# Altium project UZ_A_Template.PrjPCB
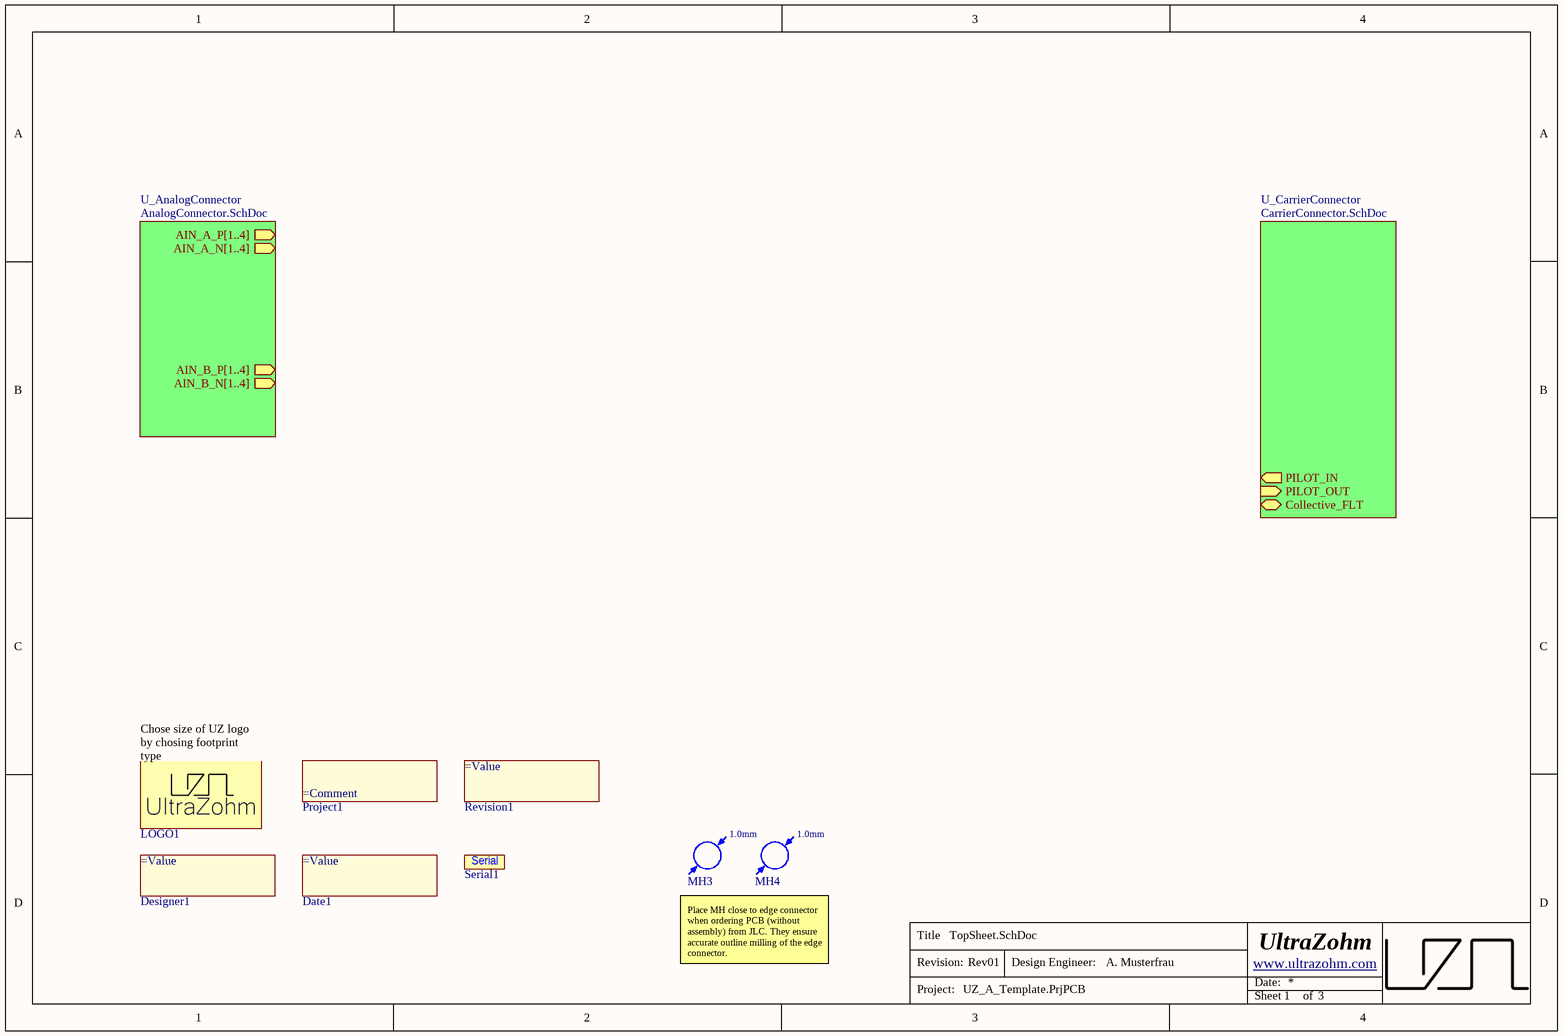
[diagram p0: TopSheet.SchDoc]
Author: A. Musterfrau; AuthorParam: A. Musterfrau; FinDate: 01/2023; ProjectNameCustom: UZ_A_Template; ProjectRevision: Rev01
3 sheets, 49 parts. Net scope: hierarchical (ports join the sheet entries above them; power ports are global).
Board file: UZ_A_Template.PcbDoc
Sheets:
  TopSheet.SchDoc
    U_CarrierConnector = CarrierConnector.SchDoc
    U_AnalogConnector = AnalogConnector.SchDoc

## Sheet TopSheet.SchDoc
size A4; Author: A. Musterfrau; CompanyName: Technische Hochschule Nürnberg Georg Simon Ohm; Organization: UltraZohm; Address1: Kesslerplatz 12; Address2: 90489 Nürnberg; Address3: GERMANY; DocumentNumber: 1; SheetNumber: 1; SheetTotal: 3; Website: www.ultrazohm.com

### Parts
Date1  (no value)  [COMMENT]  (no BOM)
Designer1  (no value)  [Designator:comment]  (no BOM)
LOGO1  UZ Logo  [UZ_Logo_small]  (value not drawn)  (no BOM)
MH3  alignment hole 1mm  [MH_1]  (value not drawn)
MH4  alignment hole 1mm  [MH_1]  (value not drawn)
Project1  (no value)  [COMMENT]  (no BOM)
Revision1  (no value)  [Designator:comment]  (no BOM)
Serial1  Serial #  [SERIAL]  (value not drawn)

### Sub-sheets
U_AnalogConnector = AnalogConnector.SchDoc: AIN_B_P[1..4] (out), AIN_B_N[1..4] (out), AIN_A_N[1..4] (out), AIN_A_P[1..4] (out)
U_CarrierConnector = CarrierConnector.SchDoc: PILOT_OUT (in), PILOT_IN (out), Collective_FLT (bidir)

### Notes on the sheet
- (near LOGO1) Chose size of UZ logo by chosing footprint type
- Place MH close to edge connector when ordering PCB (without assembly) from JLC. They ensure accurate outline milling of the edge connector.
- Title
- Revision:
- Design Engineer:
- Date:
- Project:
- Sheet
- of
- (in symbol 6) Serial
- (in symbol Mounting Hole - 1mm) 1.0mm

### Library data of the parts
Date1 = 5: Create a project parameter named "FinDate" this is the value of this component. It is printed on the PCB. Once the parameter is updated (e.g. new revision) it gets updated on the PCB as well; Manufacturer: PCB Manufacturer; Manufacturer Part Number: Project End Date; Value: 01/2023; Created from: T. Wendt; PartID: 5; Created On: 01.03.2021 09:01:41; Component Type: Date of Project Finalization; Last Updated: 01.03.2021 09:01:41; Type: Standard (No BOM); Live Cycle Status: 1
Designer1 = 4: Create a project parameter named "Author" this is the value of this component. It is printed on the PCB. Once the parameter is updated (e.g. new revision) it gets updated on the PCB as well; Manufacturer: PCB Manufacturer; Manufacturer Part Number: Project Author; Value: A. Musterfrau; Created from: T. Wendt; PartID: 4; Created On: 01.03.2021 08:53:41; Component Type: Project Author; Last Updated: 01.03.2021 09:20:27; Type: Standard (No BOM); Live Cycle Status: 1
LOGO1 = 1: Official Project Logo of the UltraZohm; Manufacturer: PCB Manufacturer; Manufacturer Part Number: UltraZohm Logo; Created from: T. Wendt; PartID: 1; Created On: 19.02.2021 16:55:56; ComponentLink1Description: Homepage; ComponentLink1URL: https://ultrazohm.com; Component Type: Logo; Last Updated: 02.03.2021 14:31:24; Type: Standard (No BOM); Live Cycle Status: 1
MH3 MH4 = Mounting Hole - 1mm: Non plated through hole, 1mm
Project1 = 2: Create a project parameter named "ProjectNameCustom" this is the value of this component and it is printed on the PCB.; Manufacturer: PCB Manufacturer; Value: UZ_A_Template; Created from: T. Wendt; PartID: 2; Created On: 01.03.2021 08:43:57; Component Type: Project Name; Last Updated: 01.03.2021 09:07:27; Manufacturer Part Number: Project Name; Type: Standard (No BOM); Live Cycle Status: 1
Revision1 = 3: Create a project parameter named "ProjectRevision" this is the value of this component. It is printed on the PCB. Once the parameter is updated (e.g. new revision) it gets updated on the PCB as well; Manufacturer: PCB Manufacturer; Value: Rev01; Created from: T. Wendt; PartID: 3; Created On: 01.03.2021 08:50:34; Component Type: Project Revision; Last Updated: 01.03.2021 09:28:36; Manufacturer Part Number: Project Revision; Type: Standard (No BOM); Live Cycle Status: 1
Serial1 = 6: Field to put in a serial number; Manufacturer: PCB Manufacturer; Created from: T. Wendt; PartID: 6; Created On: 02.03.2021 14:31:24; Component Type: Serial Number; Last Updated: 02.03.2021 14:31:24; Manufacturer Part Number: Serial Number; Type: Standard (No BOM); Live Cycle Status: 1

## Sheet CarrierConnector.SchDoc
size A4; Author: A. Musterfrau; CompanyName: Technische Hochschule Nürnberg Georg Simon Ohm; Organization: UltraZohm; Address1: Kesslerplatz 12; Address2: 90489 Nürnberg; Address3: GERMANY; DocumentNumber: 2; SheetNumber: 2; SheetTotal: 3; Website: www.ultrazohm.com
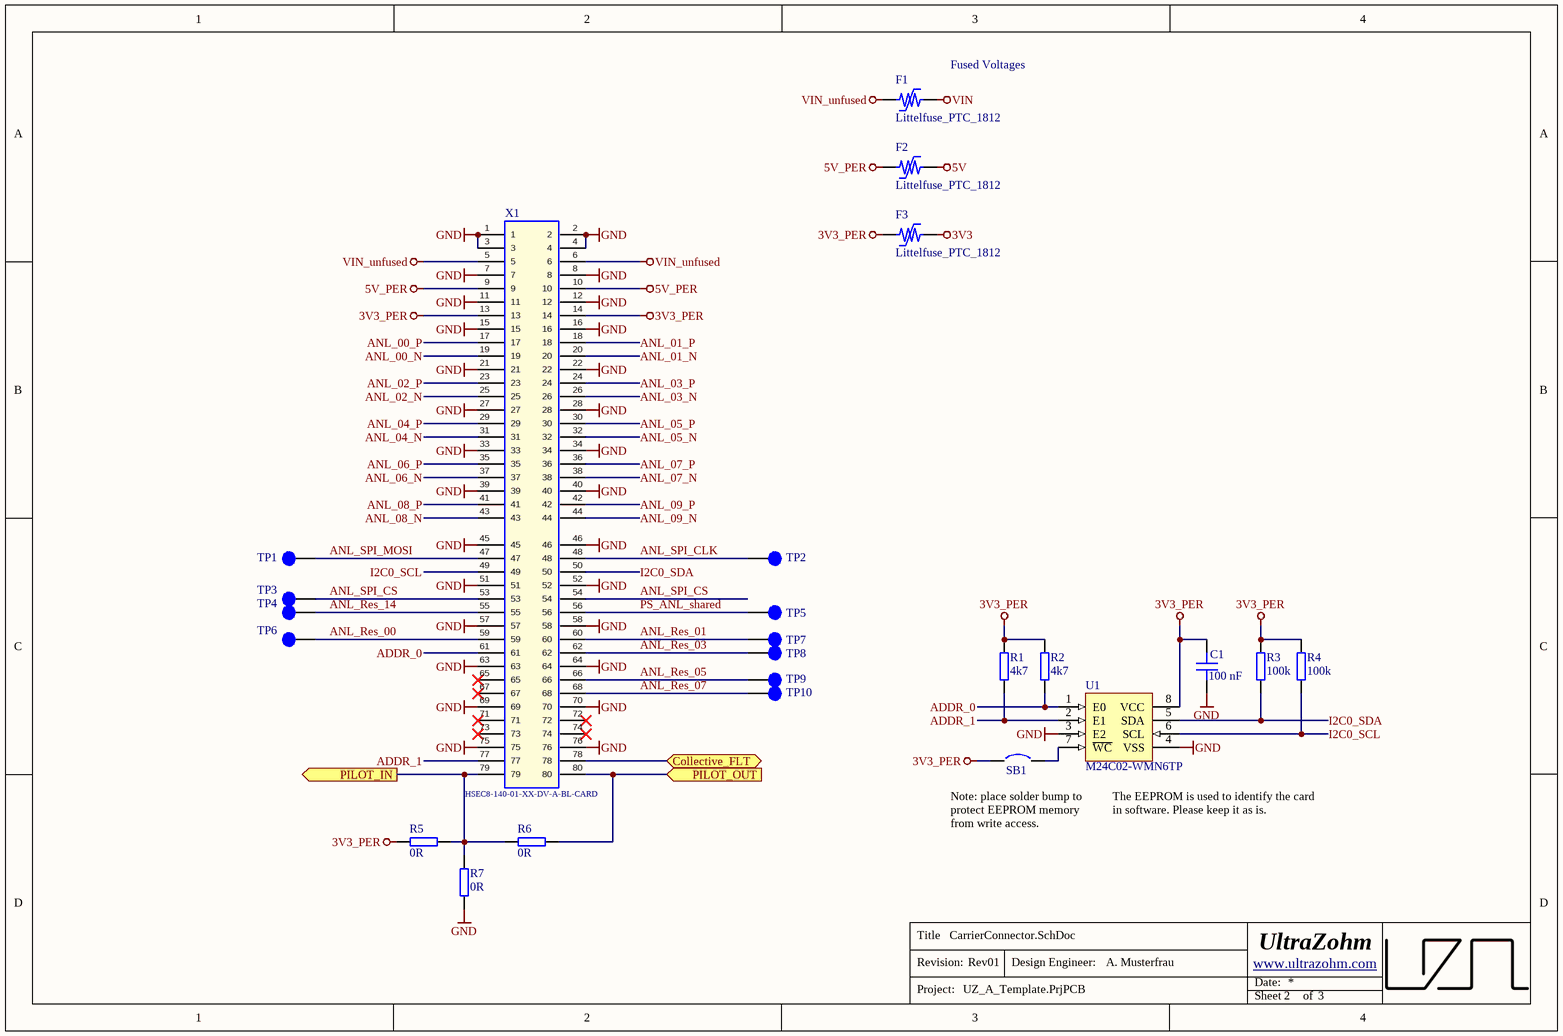
[diagram p1: CarrierConnector.SchDoc]

### Parts
C1  100 nF  [C_0603]
F1  Littelfuse_PTC_1812  [1812_PTC_Polyfuse_Littelfuse]
F2  Littelfuse_PTC_1812  [1812_PTC_Polyfuse_Littelfuse]
F3  Littelfuse_PTC_1812  [1812_PTC_Polyfuse_Littelfuse]
R1  4k7  [RES 0603_1608]
R2  4k7  [RES 0603_1608]
R3  100k  [RES 0603_1608]
R4  100k  [RES 0603_1608]
R5  0R  [RES 0603_1608]
R6  0R  [RES 0603_1608]
R7  0R  [RES 0603_1608]
SB1  Solder Bump 0603  [SB_0603]  (value not drawn)  (no BOM)
TP1  PIN47  [TP_1mm]  (value not drawn)
TP2  PIN48  [TP_1mm]  (value not drawn)
TP3  PIN53  [TP_1mm]  (value not drawn)
TP4  PIN53  [TP_1mm]  (value not drawn)
TP5  PIN56  [TP_1mm]  (value not drawn)
TP6  PIN53  [TP_1mm]  (value not drawn)
TP7  PIN53  [TP_1mm]  (value not drawn)
TP8  PIN53  [TP_1mm]  (value not drawn)
TP9  PIN53  [TP_1mm]  (value not drawn)
TP10  PIN53  [TP_1mm]  (value not drawn)
U1  M24C02-WMN6TP  [D0008A_N]
X1  HSEC8-140-01-XX-DV-A-BL-CARD  [HSEC8-140-01-XX-DV-A-BL-CARD]

### Ports
Collective_FLT (bidir), PILOT_IN (out), PILOT_OUT (in)

### Nets
3V3: F3.2
3V3_PER: C1.1 F3.1 R1.2 R2.2 R3.2 R4.2 R5.1 SB1.1 U1.8(VCC) X1.13 X1.14
5V: F2.2
5V_PER: F2.1 X1.9 X1.10
GND: C1.2 R7.1 U1.3(E2) U1.4(VSS) X1.1 X1.2 X1.3 X1.4 X1.7 X1.8 X1.11 X1.12 X1.15 X1.16 X1.21 X1.22 X1.27 X1.28 X1.33 X1.34 X1.39 X1.40 X1.45 X1.46 X1.51 X1.52 X1.57 X1.58 X1.63 X1.64 X1.69 X1.70 X1.75 X1.76
VIN: F1.2
VIN_unfused: F1.1 X1.5 X1.6
ADDR_0: R2.1 U1.1(E0) X1.61
ADDR_1: R1.1 U1.2(E1) X1.77
ANL_00_N: X1.19
ANL_00_P: X1.17
ANL_01_N: X1.20
ANL_01_P: X1.18
ANL_02_N: X1.25
ANL_02_P: X1.23
ANL_03_N: X1.26
ANL_03_P: X1.24
ANL_04_N: X1.31
ANL_04_P: X1.29
ANL_05_N: X1.32
ANL_05_P: X1.30
ANL_06_N: X1.37
ANL_06_P: X1.35
ANL_07_N: X1.38
ANL_07_P: X1.36
ANL_08_N: X1.43
ANL_08_P: X1.41
ANL_09_N: X1.44
ANL_09_P: X1.42
ANL_Res_00: TP6.1 X1.59
ANL_Res_01: TP7.1 X1.60
ANL_Res_03: TP8.1 X1.62
ANL_Res_05: TP9.1 X1.66
ANL_Res_07: TP10.1 X1.68
ANL_Res_14: TP4.1 X1.55
ANL_SPI_CLK: TP2.1 X1.48
ANL_SPI_CS: TP3.1 X1.53 X1.54
ANL_SPI_MOSI: TP1.1 X1.47
I2C0_SCL: R4.1 U1.6(SCL) X1.49
I2C0_SDA: R3.1 U1.5(SDA) X1.50
PS_ANL_shared: TP5.1 X1.56
NetR5_2: R5.2 R6.1 R7.2 X1.79 ; port PILOT_IN
NetR6_2: R6.2 X1.80 ; port PILOT_OUT
NetSB1_2: SB1.2 U1.7(~{WC})
NetX1_78: X1.78 ; port Collective_FLT

Not connected (* = marked no-connect by the designer): X1 65* 67* 71* 72* 73* 74*

### Notes on the sheet
- (near F1) Fused Voltages
- Note: place solder bump to protect EEPROM memory from write access.
- (near U1) The EEPROM is used to identify the card in software. Please keep it as is.
- Title
- Revision:
- Design Engineer:
- Date:
- Project:
- Sheet
- of

### Library data of the parts
C1 = C0603C104K9PACTU: Capacitor 0603, 6.3 VDC, 100 nF, X5R; Manufacturer: KEMET; Tolerance: 10 %; Voltage Rating: 6.3 VDC; Created from: MGremer; Manufacturer Part Number: C0603C104K9PACTU; PartID: 70; Created On: 20.12.2020 13:54:13; ComponentLink1Description: Datasheet; ComponentLink1URL: https://www.mouser.de/datasheet/2/212/KEM_C1006_X5R_SMD-1103249.pdf; Component Type: Capacitor 0603; Device Package: 0603; Last Updated: 20.01.2021 13:57:36; Mounting Type: SMD; Operating Temperature: -55 - 85°C; Series: SMD Comm X5R; Supplier 1: Mouser; Supplier Part Number 1: 80-C0603C104K9P; Type: Capacitor; Value: 100 nF; Live Cycle Status: 1; Stock number: not stored
F1-F3 = Littelfuse_PTC_1812: POLYSWITCH RESETTABLE DEVICES; MPN: miniASMDC110F/24; Value: PTC, 1.1 A, 24V; Voltage: 24V; Trip Current: 2.2A; Hold Current: 1.1A; Resistance: 0.18 Ohm; Type: Fuse; Nominal current: 1 A; Created from: MHlatky; MF: Littelfuse; Created: 2019_02_10_AGeiger; Package: 1812; ComponentLink1URL: https://www.littelfuse.com/~/media/electronics/datasheets/resettable_ptcs/littelfuse_ptc_surface_mount_catalog_datasheet.pdf.pdf; ComponentLink1Description: Datasheet; Manufacturer Part Number: Littelfuse_PTC_1812; PartID: 5; Created On: 07.05.2021 06:50:33; Component Type: Littelfuse_PTC_1812; Last Updated: 27.05.2022 15:06:17; Manufacturer: Littelfuse; Mounting Type: SMD; Operating Temperature: -40 - 85 °C; Supplier 1: Mouser; Supplier Part Number 1: 530-0ZCG0150BF2C; Live Cycle Status: 1; LCSC Part Number: C70119
R1 R2 = 0603WAF4701T5E: SMD resistor E24 series; Manufacturer: UNI-ROYAL; Tolerance: 1%; Created from: AGeiger; Manufacturer Part Number: 0603WAF4701T5E; PartID: 90; Created On: 14.12.2020 16:17:14; ComponentLink1Description: Datasheet; ComponentLink1URL: https://datasheet.lcsc.com/lcsc/2206010116_UNI-ROYAL-Uniroyal-Elec-0603WAF4701T5E_C23162.pdf; Component Type: SMD resistor; Device Package: 0603; Last Updated: 25.08.2022 20:03:04; Mounting Type: SMD; Supplier 1: LCSC; Supplier Part Number 1: C23162; Type: Resistor; Value: 4k7; Live Cycle Status: 1; Stock number: Labor SMD Container; LCSC Part Number: C23162
R3 R4 = RK73B1JTTD104J: SMD resistor E24 series; Manufacturer: KOA Speer; Tolerance: 5%; Created from: MGremer; Manufacturer Part Number: RK73B1JTTD104J; PartID: 122; Created On: 14.12.2020 16:17:14; ComponentLink1Description: Datasheet; ComponentLink1URL: https://www.mouser.de/datasheet/2/219/RK73B-1825463.pdf; Component Type: SMD resistor; Device Package: 0603; Last Updated: 27.05.2022 14:04:10; Mounting Type: SMD; Supplier 1: Mouser; Supplier Part Number 1: 660-RK73B1JTTD104J; Type: Resistor; Value: 100k; Live Cycle Status: 1; Stock number: Labor SMD Container; LCSC Part Number: C25803
R5-R7 = RC0603JR-070RL: SMD resistor E24 series; Manufacturer: YAGEO; Tolerance: 5%; Created from: MGremer; Manufacturer Part Number: RC0603JR-070RL; PartID: 1; Created On: 14.12.2020 16:17:14; ComponentLink1Description: Datasheet; ComponentLink1URL: https://www.mouser.de/datasheet/2/447/PYu-RC_Group_51_RoHS_L_10-1664068.pdf; Component Type: SMD resistor; Device Package: 0603; Last Updated: 04.03.2021 09:09:42; Mounting Type: SMD; Supplier 1: Mouser; Supplier Part Number 1: 603-RC0603JR-070RL; Supplier 2: LCSC; Supplier Part Number 2: C21189; Type: Resistor; Value: 0R; Live Cycle Status: 1; Stock number: Labor SMD Container; LCSC Part Number: C21189
SB1 = =Value: Created from: AGeiger; Revision: July-2002: Re-released for DXP Platform.; PartID: 1; Created On: 09.01.2024 17:13:56; Component Type: Solder Bump; Device Package: 0603; Last Updated: 09.01.2024 17:13:56; Manufacturer Part Number: Solder Bump 0603; Mounting Type: SMD; Value: Solder Bump 0603
TP1-TP10 = TP_1mm: Testpoint 1mm; Created: 2018_06_25_AGeiger; Value: Testpoint 1mm
U1 = M24C02-WMN6TP: 2Kbit I2C SOP-8 EEPROM ROHS; Manufacturer: STMicroelectronics; Created from: AGeiger; Manufacturer Part Number: M24C02-WMN6TP; PartID: 1; Created On: 19.11.2023 14:54:27; ComponentLink1Description: Datasheet; ComponentLink1URL: https://www.st.com/resource/en/datasheet/m24c01-w.pdf; Component Type: EEPROM; Device Package: SOIC-8; Last Updated: 19.11.2023 21:39:04; Mounting Type: SMD; Operating Temperature: -40 to +85 °C; Series: M24xxx; Supplier 1: Mouser; Supplier Part Number 1: 511-M24C02-WMN6TP; Supplier 2: LCSC; Supplier Part Number 2: C7562; Type: Memory; Value: M24C02-WMN6TP; LCSC Part Number: C7562
X1 = HSEC8-140-01-XX-DV-A-BL-CARD: Mating Card Layout for HSEC8-140-01-XX-DV-A-BL; Manufacturer: SAMTEC; Created: 2018_04_23_AGeiger; Value: HSEC8-140-01-XX-DV-A-BL-CARD

## Sheet AnalogConnector.SchDoc
size A4; Author: A. Musterfrau; CompanyName: Technische Hochschule Nürnberg Georg Simon Ohm; Organization: UltraZohm; Address1: Kesslerplatz 12; Address2: 90489 Nürnberg; Address3: GERMANY; DocumentNumber: 3; SheetNumber: 3; SheetTotal: 3; Website: www.ultrazohm.com
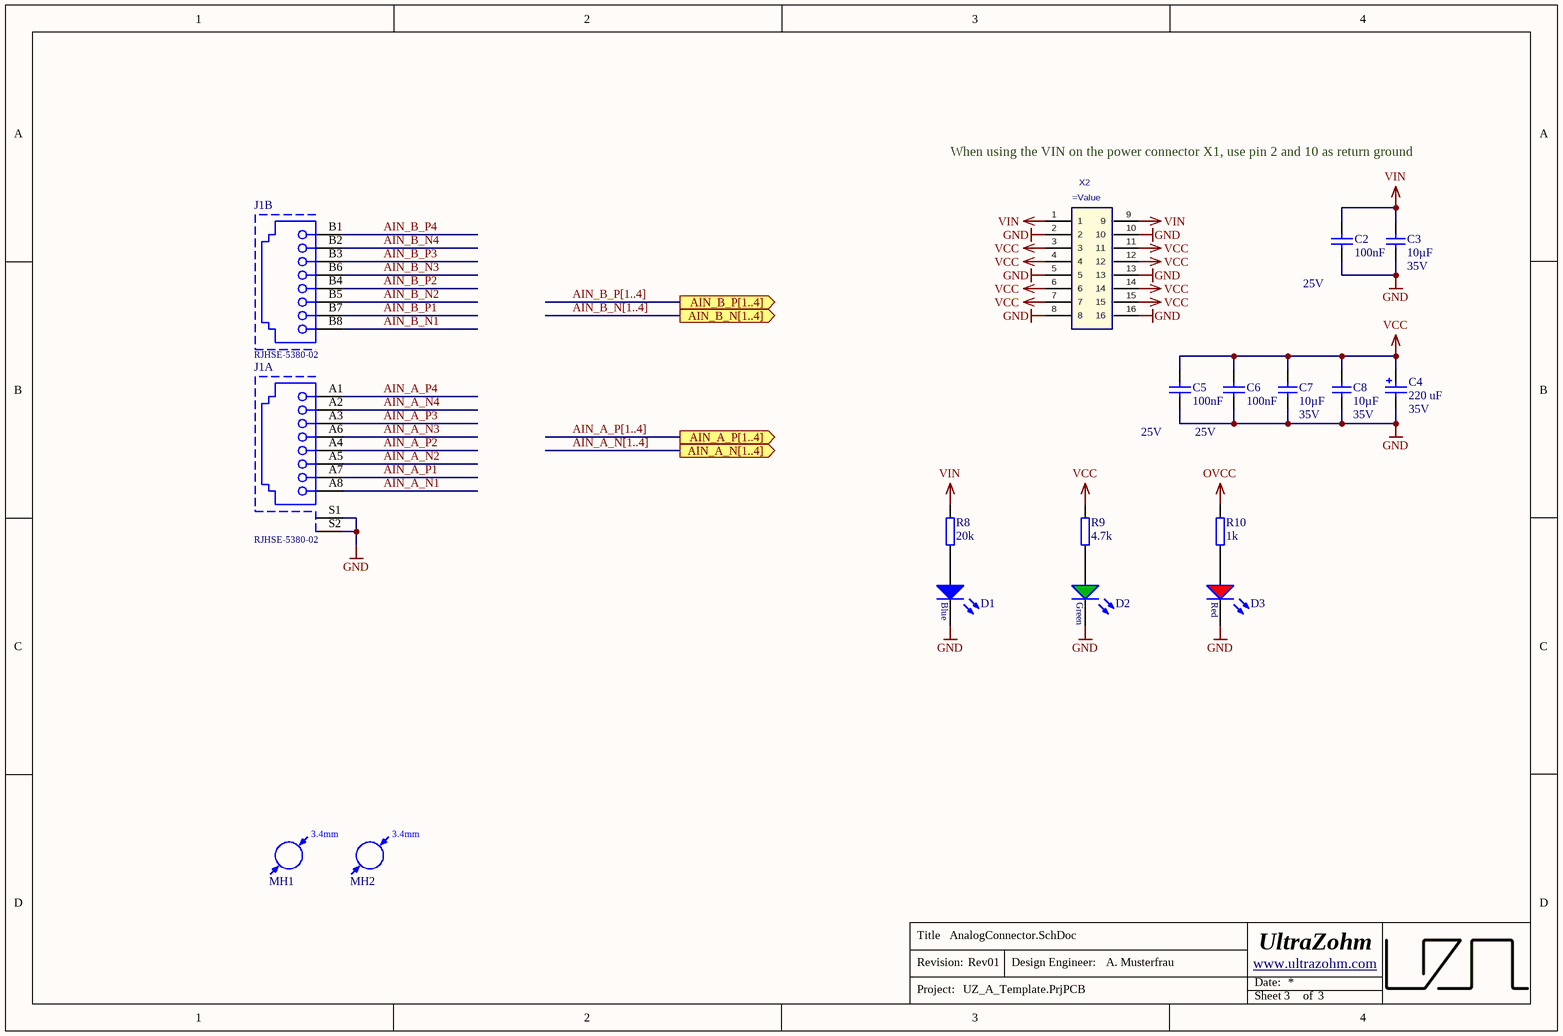
[diagram p2: AnalogConnector.SchDoc]

### Parts
C2  100nF  Voltage: 25V  [CAPC1608X07N]
C3  10µF  Voltage: 35V  [C_1206]
C4  220 uF  Voltage: 35V  [WCAP-ATG5_8x11.5x3.5]
C5  100nF  Voltage: 25V  [CAPC1608X07N]
C6  100nF  Voltage: 25V  [CAPC1608X07N]
C7  10µF  Voltage: 35V  [C_1206]
C8  10µF  Voltage: 35V  [C_1206]
D1  150060BS75000  [WL-SMCW_0603]  (value not drawn)
D2  150060GS75000  [WL-SMCW_0603]  (value not drawn)
D3  150060RS75000  [WL-SMCW_0603]  (value not drawn)
J1  RJHSE-5380-02  [RJHSE-5380-02]  (parts A,B of 2)
MH1  mounting hole 3,4mm  [MH_3.4]  (value not drawn)
MH2  mounting hole 3,4mm  [MH_3.4]  (value not drawn)
R8  20k  [RESC1608X06N]
R9  4.7k  [RESC1608X06N]
R10  1k  [RESC1608X06N]
X2  (no value)  [IPL1-108-01-L-D-RA-K]

### Ports
AIN_A_N[1..4] (out), AIN_A_P[1..4] (out), AIN_B_N[1..4] (out), AIN_B_P[1..4] (out)

### Nets
GND: C2.1 C3.1 C4.2(N) C5.1 C6.1 C7.1 C8.1 D1.1(K) D2.1(K) D3.1(K) J1.S1 J1.S2 X2.2 X2.5 X2.8 X2.10 X2.13 X2.16
OVCC: R10.2
VCC: C4.1(P) C5.2 C6.2 C7.2 C8.2 R9.2 X2.3 X2.4 X2.6 X2.7 X2.11 X2.12 X2.14 X2.15
VIN: C2.2 C3.2 R8.2 X2.1 X2.9
AIN_A_N1: J1.A8
AIN_A_N2: J1.A5
AIN_A_N3: J1.A6
AIN_A_N4: J1.A2
AIN_A_P1: J1.A7
AIN_A_P2: J1.A4
AIN_A_P3: J1.A3
AIN_A_P4: J1.A1
AIN_B_N1: J1.B8
AIN_B_N2: J1.B5
AIN_B_N3: J1.B6
AIN_B_N4: J1.B2
AIN_B_P1: J1.B7
AIN_B_P2: J1.B4
AIN_B_P3: J1.B3
AIN_B_P4: J1.B1
NetD1_2: D1.2(A) R8.1
NetD2_2: D2.2(A) R9.1
NetD3_2: D3.2(A) R10.1

### Buses and harness runs
bus AIN_A_N[1..4] = port AIN_A_N[1..4]
bus AIN_A_P[1..4] = port AIN_A_P[1..4]
bus AIN_B_N[1..4] = port AIN_B_N[1..4]
bus AIN_B_P[1..4] = port AIN_B_P[1..4]

### Notes on the sheet
- When using the VIN on the power connector X1, use pin 2 and 10 as return ground
- Title
- Revision:
- Design Engineer:
- Date:
- Project:
- Sheet
- of
- (in symbol Mounting Hole) 3.4mm

### Library data of the parts
C2 C5 C6 = Cap_0603: MPN: 885012206071; MF: Würth; Dielectric: X7R; Value: 100nF; Supplier 1: Mouser; Supplier 2: *; Supplier Part Number 1: 710-885012206071; Supplier Part Number 2: *; Package: 0603
C3 C7 C8 = C_1206: Capacitor 1206; MPN: GRM319R6YA106KA12D; Tolerance: 10%; MF: Murata Electronics; Dielectric: X5R; Package: 1206; Value: 10µF; Created: 2018_06_25_AGeiger; Supplier 1: Mouser; Supplier Part Number 1: 81-GRM319R6YA106KA2D
C4 = 860020574012: WCAP-ATG5 Aluminum Electrolytic Capacitors, 8x11.5mm, 35 Vdc, 220 uF; MF: Wurth Elektronik; ComponentLink1Description: Manufacturer; ComponentLink1URL: http://www.we-online.de; ComponentLink2Description: Datasheet; ComponentLink2URL: http://katalog.we-online.com/pbs/datasheet/860020574012.pdf; Part Number: 860020574012; Published Date: Sep. 2017; Size: 8x11.5mm; Life Cycle: 2000h; Operating Temperature: -40 °C up to +105 °C; Value: 220 uF; MPN: 860020574012; Supplier 1: Mouser; Supplier Part Number 1: 710-860020574012
D1 = LED_Blue_0603: WL-SMCW SMD Mono-color Chip LED Waterclear, size 0603, Blue, 3.2 V, 140°; Forward Voltage: 3.2 V; Luminous Intensity: 145 mcd; Peak Wavelength: 465 nm; Dominant Wavelength: 470 nm; MF: Wuerth Elektronik; Published Date: Sep. 2017; ComponentLink1Description: Manufacturer; ComponentLink1URL: http://www.we-online.de; ComponentLink2Description: Datasheet; ComponentLink2URL: http://katalog.we-online.com/led/datasheet/150060BS75000.pdf; MPN: 150060BS75000; Size: 0603; Viewing Angle: 140°; Emitting Color: Blue; Value: 150060BS75000; Package: 0603; Created: 2018_09_06_AGeiger; Supplier 1: Farnell; Supplier Part Number 1: 2322069; Supplier 2: Mouser; Supplier Part Number 2: 710-150060BS75000; Supplier 3: Digi-Key; Supplier Part Number 3: 732-4966-1-ND
D2 = LED_Green_0603: WL-SMCW SMD Mono-color Chip LED Waterclear, size 0603, Green, 3.2 V, 140°; Forward Voltage: 3.2 V; Luminous Intensity: 430 mcd; Peak Wavelength: 515 nm; Dominant Wavelength: 520 nm; MF: Wuerth Elektronik; Published Date: Sep. 2017; ComponentLink1Description: Manufacturer; ComponentLink1URL: http://www.we-online.de; ComponentLink2Description: Datasheet; ComponentLink2URL: http://katalog.we-online.com/led/datasheet/150060GS75000.pdf; MPN: 150060GS75000; Size: 0603; Viewing Angle: 140°; Emitting Color: Green; Value: 150060GS75000; Package: 0603; Created: 2018_09_06_AGeiger; Supplier 1: Farnell; Supplier Part Number 1: 2322070; Supplier 2: Mouser; Supplier Part Number 2: 710-150060GS75000; Supplier 3: Digi-Key; Supplier Part Number 3: 732-4971-1-ND
D3 = LED_Red_0603: WL-SMCW SMD Mono-color Chip LED Waterclear, size 0603, Red, 2 V, 140°; Forward Voltage: 2 V; Luminous Intensity: 250 mcd; Peak Wavelength: 630 nm; Dominant Wavelength: 625 nm; MF: Wuerth Elektronik; Published Date: Sep. 2017; ComponentLink1Description: Manufacturer; ComponentLink1URL: http://www.we-online.de; ComponentLink2Description: Datasheet; ComponentLink2URL: http://katalog.we-online.com/led/datasheet/150060RS75000.pdf; MPN: 150060RS75000; Size: 0603; Viewing Angle: 140°; Emitting Color: Red; Value: 150060RS75000; Package: 0603; Created: 2018_09_06_AGeiger; Supplier 1: Farnell; Supplier Part Number 1: 2322071; Supplier 2: Mouser; Supplier Part Number 2: 710-150060RS75000; Supplier 3: Digi-Key; Supplier Part Number 3: 732-4978-1-ND
J1 = RJHSE-5380-02: Modular Jack WR-MJ, Tab Up, Shielded, Dual Port, Righ Angle, THT, 8P8C; MF: Amphenol; Port: 1x2; Entrance: Right Angle; Compliance: Lead free / RoHS; Rated Current: 1.5 A; Working Voltage: 120 VAC; Withstanding Voltage: 1000 VAC; Contact Resistance: 20 mOhm; ComponentLink1Description: Manufacturer; ComponentLink1URL: http://www.we-online.de; ComponentLink2Description: Datasheet; ComponentLink2URL: https://katalog.we-online.de/em/datasheet/615016137621.pdf; MPN: RJHSE-5380-02; Published Date: July 2018; Pin Number: 8P8C; Operating Temperature: -40 to 85 degC; Mounting Technology: THT; Packaging: Tray; Supplier 1: Mouser; Supplier Part Number 1: 523-RJHSE-5380-02
MH1 MH2 = Mounting Hole: Non plated through hole, 3.4mm
R8 = R_0603: MPN: CRCW060320K0JNEAC; MF: Vishay / Dale; Value: 20k; Supplier 1: Mouser; Supplier Part Number 1: 71-CRCW060320K0JNEAC; Package: 0603
R9 = R_0603: MPN: CRCW06034K70JNEAC; MF: Vishay / Dale; Value: 4.7k; Supplier 1: Mouser; Supplier Part Number 1: 71-CRCW06034K70JNEAC; Package: 0603
R10 = R_0603: MPN: CRCW06031K00JNEAC; MF: Vishay / Dale; Value: 1k; Supplier 1: Mouser; Supplier Part Number 1: 71-CRCW06031K00JNEAC; Package: 0603
X2 = IPL1-108-XX-X-D-X: 2.54mm Double Row Terminal Assembly; MF: SAMTEC; Created: 2018_09_17_AGeiger; Value: =MPN; MPN: IPL1-108-01-L-D-RA-K; Supplier 1: Mouser; Supplier Part Number 1: 200-IPL110801LDRAK

## Nets that join several sheets
GND: CarrierConnector (34 pins), AnalogConnector (18 pins)
VIN: CarrierConnector (F1.2), AnalogConnector (5 pins)

## Assembly variants
Default: not fitted R7 R9